# EAGLE schematic ConcentradorC (EAGLE 7.6.0)
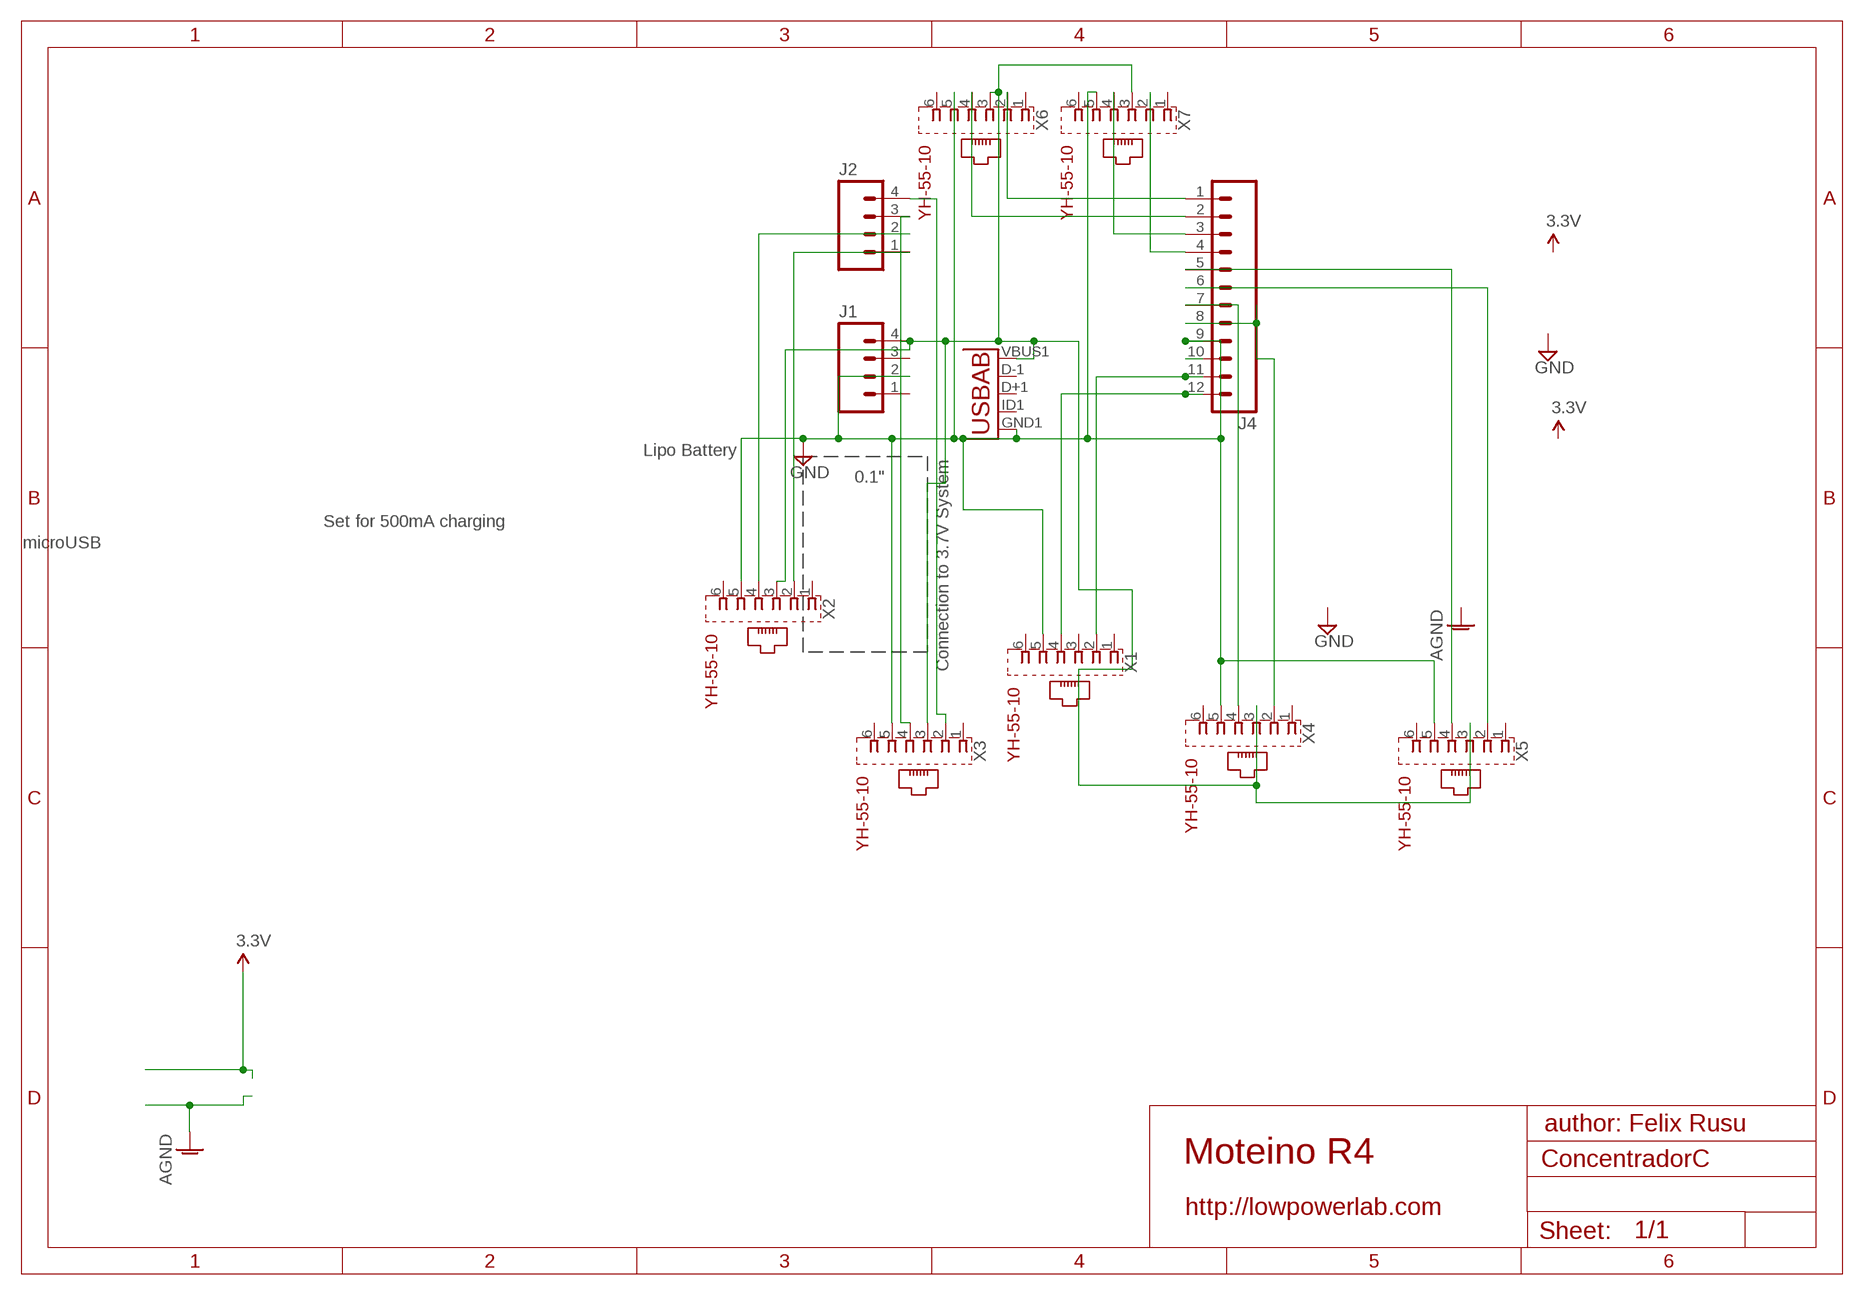
[diagram p0: schematic, sheet 1]

## Parts
J1  M04PTH  [1X04]
J2  M04PTH  [1X04]
J4  M12PTH  [1X12]
JP9  Micro USB  USB-ABCONN-11794  [USB-AB-MICRO-SMD_V03]
X1  YH-55-10  [YH-55-10]
X2  YH-55-10  [YH-55-10]
X3  YH-55-10  [YH-55-10]
X4  YH-55-10  [YH-55-10]
X5  YH-55-10  [YH-55-10]
X6  YH-55-10  [YH-55-10]
X7  YH-55-10  [YH-55-10]

## Nets
GND [power]: J1.2 J4.9 JP9.GND1(GND) X1.5 X2.5 X3.5 X4.5 X5.5 X6.5 X7.5
N$1: J4.5 X5.4
N$2: J4.6 X5.2
N$3: J4.3 X7.4
N$4: J4.12 X1.4
N$5: J4.11 X1.2
N$6: J4.10
N$7: J4.4 X7.2
N$8: J4.7 X4.4
N$9: J4.8 X4.2
N$10: J4.2 X6.4
N$11: J4.1 X6.2
N$12: J2.4 X3.2
N$13: J2.3 X3.4
N$14: J2.2 X2.4
N$15: J2.1 X2.2
VIN: J1.4 JP9.VBUS1(VBUS) X2.3 X3.3 X4.3 X5.3 X6.3 X7.3
Unconnected: J1.1 J1.3 JP9.D+1(D+) JP9.D-1(D-) JP9.ID1(USBID) X1.1 X1.3 X1.6 X2.1 X2.6 X3.1 X3.6 X4.1 X4.6 X5.1 X5.6 X6.1 X6.6 X7.1 X7.6

## Notes on the sheet
- Lipo Battery
- 0.1"
- Set for 500mA charging
- microUSB
- Connection to 3.7V System
- author: Felix Rusu
- Moteino R4
- http://lowpowerlab.com

## Library data of the parts
J1 J2 = SparkFun-Connectors:M04: Header 4 Standard 4-pin 0.1" header. Use with straight break away headers (SKU : PRT-00116), right angle break away headers (PRT-00553), swiss pins (PRT-00743), machine pins (PRT-00117), and female headers (PRT-00115). Molex polarized connector foot print use with SKU : PRT-08231 with associated crimp pins and housings. 1MM SMD Version SKU: PRT-10208; PROD_ID: CONN-09696
J4 = SparkFun-Connectors:M12: Header 12 Standard 12-pin 0.1" header. Use with straight break away headers (SKU : PRT-00116), right angle break away headers (PRT-00553), swiss pins (PRT-00743), machine pins (PRT-00117), and female headers (PRT-00115).
JP9 = SparkFun-Connectors:USB-AB: This is a USB AB connector that is compatible with USB OTG. i.e. this connector can serve as a host or device; PROD_ID: CONN-11794
X1-X7 = con-wenzhou-yihua:YH-55-10: RJ11 6 connects Source: YH-55-10.pdf; OC_FARNELL: unknown; OC_NEWARK: unknown

## Net classes
1 power: width 0.381 mm, clearance 0.254 mm